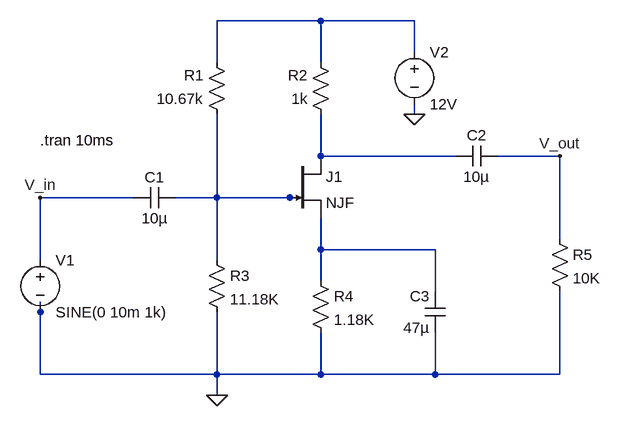
[diagram p0: schematic Lab - 05.asc]
Lab - 05.asc, the LTspice schematic file:
Version 4
SHEET 1 920 680
WIRE 432 -80 272 -80
WIRE 576 -80 432 -80
WIRE 576 -32 576 -80
WIRE 272 -16 272 -80
WIRE 432 -16 432 -80
WIRE 576 64 576 48
WIRE 432 128 432 64
WIRE 640 128 432 128
WIRE 800 128 704 128
WIRE 432 144 432 128
WIRE 144 192 0 192
WIRE 272 192 272 64
WIRE 272 192 208 192
WIRE 384 192 272 192
WIRE 400 192 384 192
WIRE 800 256 800 128
WIRE 432 272 432 224
WIRE 608 272 432 272
WIRE 0 288 0 192
WIRE 272 288 272 192
WIRE 432 320 432 272
WIRE 608 336 608 272
WIRE 0 368 0 352
WIRE 0 464 0 368
WIRE 272 464 272 368
WIRE 272 464 0 464
WIRE 432 464 432 400
WIRE 432 464 272 464
WIRE 608 464 608 400
WIRE 608 464 432 464
WIRE 800 464 800 336
WIRE 800 464 608 464
WIRE 272 496 272 464
FLAG 576 64 0
FLAG 272 496 0
FLAG 0 192 V_in
FLAG 800 128 V_out
SYMBOL voltage 0 272 R0
SYMATTR InstName V1
SYMATTR Value SINE(0 10m 1k)
SYMBOL cap 208 176 R90
WINDOW 0 0 32 VBottom 2
WINDOW 3 32 32 VTop 2
SYMATTR InstName C1
SYMATTR Value 10µ
SYMBOL voltage 576 -48 R0
SYMATTR InstName V2
SYMATTR Value 12V
SYMBOL res 288 80 R180
WINDOW 0 36 76 Left 2
WINDOW 3 36 40 Left 2
SYMATTR InstName R1
SYMATTR Value 10.67k
SYMBOL res 448 80 R180
WINDOW 0 36 76 Left 2
WINDOW 3 36 40 Left 2
SYMATTR InstName R2
SYMATTR Value 1k
SYMBOL res 256 272 R0
SYMATTR InstName R3
SYMATTR Value 11.18K
SYMBOL res 416 304 R0
SYMATTR InstName R4
SYMATTR Value 1.18K
SYMBOL res 784 240 R0
SYMATTR InstName R5
SYMATTR Value 10K
SYMBOL cap 704 112 R90
WINDOW 0 0 32 VBottom 2
WINDOW 3 32 32 VTop 2
SYMATTR InstName C2
SYMATTR Value 10µ
SYMBOL cap 624 400 R180
WINDOW 0 24 56 Left 2
WINDOW 3 24 8 Left 2
SYMATTR InstName C3
SYMATTR Value 47µ
SYMBOL njf 384 128 R0
SYMATTR InstName J1
TEXT 0 104 Left 2 !.tran 10ms

The netlist it stands for:
* Lab - 05.asc
V1 V_in 0 SINE(0 10m 1k)
C1 N003 V_in 10µ
V2 N001 0 12V
R1 N003 N001 10.67k
R2 N002 N001 1k
R3 N003 0 11.18K
R4 N004 0 1.18K
R5 V_out 0 10K
C2 V_out N002 10µ
C3 0 N004 47µ
J1 N002 N003 N004 NJF
.model NJF NJF
.model PJF PJF
.lib standard.jft
.tran 10ms
.backanno
.end